# Altium schematic sheet display.SchDoc
size A4; SheetNumber: 1; SheetTotal: 1
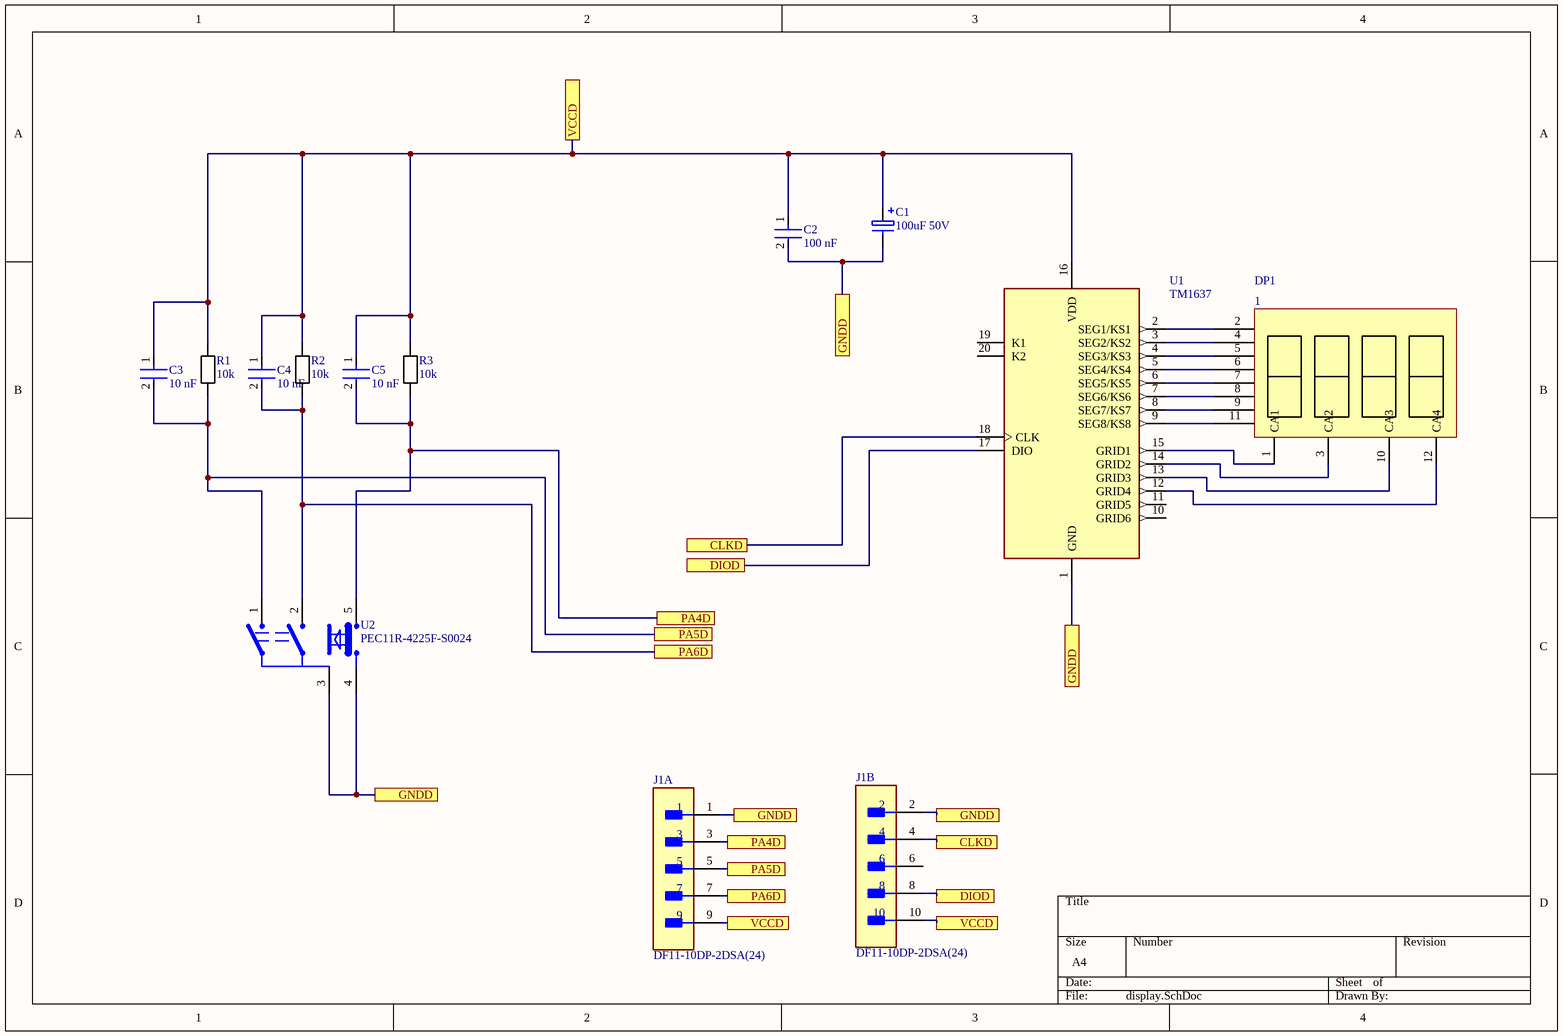
[diagram p0: display.SchDoc]

## Parts
1  DP1  [7sigment]
C1  100uF 50V  [Elco 100uF 50V]
C2  100 nF  [0805]
C3  10 nF  [0805]
C4  10 nF  [0805]
C5  10 nF  [0805]
J1  DF11-10DP-2DSA(24)  [FP-DF11-10DP-2DSA_24-MFG - duplicate]  (parts A,B of 2)
R1  10k  [registor]
R2  10k  [registor]
R3  10k  [registor]
U1  TM1637  [TM1637]
U2  PEC11R-4225F-S0024  [PEC12R-4XXXF-SXXXX_1]

## Ports
CLKD (see display[2C]), CLKD (see display[3D]), DIOD (see display[2C]), DIOD (see display[3D]), GNDD (see display[1D], display[2D], display[3B], display[3C]), GNDD (see display[1D], display[2D], display[3B], display[3D]), GNDD (see display[1D], display[2D], display[3C], display[3D]), GNDD (see display[1D], display[3B], display[3C], display[3D]), GNDD (see display[2D], display[3B], display[3C], display[3D]), PA4D (see display[2C]), PA4D (see display[2D]), PA5D (see display[2C]), PA5D (see display[2D]), PA6D (see display[2C]), PA6D (see display[2D]), VCCD (see display[2A], display[2D]), VCCD (see display[2A], display[3D]), VCCD (see display[2D], display[3D])

## Nets
CLKD: J1.4 U1.18(CLK) ; port CLKD
DIOD: J1.8 U1.17(DIO) ; port DIOD
GNDD: C1.2 C2.2 J1.1 J1.2 U1.1(GND) U2.3 U2.4 ; port GNDD
PA4D: C5.2 J1.3 R3.1 U2.5 ; port PA4D
PA5D: C3.2 J1.5 R1.1 U2.1 ; port PA5D
PA6D: C4.2 J1.7 R2.1 U2.2 ; port PA6D
VCCD: C1.1 C2.1 C3.1 C4.1 C5.1 J1.9 J1.10 R1.2 R2.2 R3.2 U1.16(VDD) ; port VCCD
Net1_1: 1.1(CA1) U1.15(GRID1)
Net1_2: 1.2 U1.2(SEG1/KS1)
Net1_3: 1.3(CA2) U1.14(GRID2)
Net1_4: 1.4 U1.3(SEG2/KS2)
Net1_5: 1.5 U1.4(SEG3/KS3)
Net1_6: 1.6 U1.5(SEG4/KS4)
Net1_7: 1.7 U1.6(SEG5/KS5)
Net1_8: 1.8 U1.7(SEG6/KS6)
Net1_9: 1.9 U1.8(SEG7/KS7)
Net1_10: 1.10(CA3) U1.13(GRID3)
Net1_11: 1.11 U1.9(SEG8/KS8)
Net1_12: 1.12(CA4) U1.12(GRID4)

Not connected (* = marked no-connect by the designer): J1 6; U1 10(GRID6) 11(GRID5) 19(K1) 20(K2)

## Library data of the parts
1 = 7sigment
C1 = condensator 100uF 50V: Part Number: 02015A270JAT2A; Manufacturer: AVX Interconnect / Elco
C2-C5 = Condensator 0805: Chip Multilayer Ceramic Capacitors for General Purpose, 0805, 10uF, X5R, 15%, 10%, 25V; Length: 2mm; Depth: 1.25mm; Termination: SMD/SMT; Voltage: 25V; Height: 1.25mm; Material: Ceramic; Thickness: 0.053inch; Radiation Hardening: No; Min Operating Temperature: -55°C; Width: 0.049inch; Package Quantity: 1; Mount: Surface Mount; Dielectric: X5R; Packaging: Tape and Reel; Capacitance: 10uF; Voltage Rating (DC): 25V; Lead Free: Lead Free; Max Operating Temperature: 85°C; Case Code (Imperial): 0805; Case/Package: 0805; Tolerance: 10%; Voltage Rating: 25V; Case Code (Metric): 2012
J1 = CMP-11610-000008-1: CONN HEADER VERT 10POS 2MM; Manufacturer: Hirose; Number Of Contacts: 10; Voltage Rating: 250V; Conn Orientation: Straight; Conn Gender: Male; Current Rating: 2A; Temperature Range High: +85°C; RoHS: TRUE; Device Class L2: Headers and Wire Housings; ComponentLink2URL: https://www.hirose.com/product/document?clcode=CL0543-0520-0-24&productname=DF11-10DP-2DSA(24)&series=DF11&documenttype=Catalog&lang=en&documentid=D31688_en; Height: 6.9mm; Package: DF11-10DP-2DSA(24); ComponentLink2Description: Datasheet; Automotive: No; Digikey Description: CONN HEADER VERT 10POS 2MM; Manufacturer Part Number: DF11-10DP-2DSA(24); Temperature: -40°C to +85°C; Octopart: https://octopart.com/df11-10dp-2dsa%2824%29-hirose-39521433; Number Of Rows: 2; Device Class L3: unset; Contact Material: Tin,Nickel; Mouser Description: Headers & Wire Housings 10P STRT HEADER THRU HL,BD MNT,SN; Category: Conn; Device Class L1: Connectors; Temperature Range Low: -40°C; Pitch: 2mm; Lead Free: Yes; Footprint Url: https://www.hirose.com/product/document?clcode=CL0543-0520-0-24&productname=DF11-10DP-2DSA(24)&series=DF11&documenttype=2DDrawing&lang=en&documentid=0000995333
R1-R3 = resistor: Manufacturer: Vishay Dale; Part Number: CRCW08050000Z0EA
U1 = TM1637: LED Drive Control Special Circuit; MF: Titan Micro Electronics; Package: Package; Availability: Not in stock; SnapEDA_Link: https://www.snapeda.com/parts/TM1637/Titan+Micro+Electronics/view-part/?ref=snap; MP: TM1637; Check_prices: https://www.snapeda.com/parts/TM1637/Titan+Micro+Electronics/view-part/?ref=eda; Value: *; Price: None
U2 = encoder: Rotary Button; Manufacturer_Name: Bourns; Datasheet Link: https://componentsearchengine.com/Datasheets/1/PEC11R-4225F-S0024.pdf; Manufacturer_Part_Number: PEC11R-4225F-S0024; Mouser Part Number: 652-PEC11R-4225F-S24; Mouser Price/Stock: https://www.mouser.co.uk/ProductDetail/Bourns/PEC11R-4225F-S0024?qs=Zq5ylnUbLm4N6UNkPX3pkQ%3D%3D; Arrow Part Number: PEC11R-4225F-S0024; Arrow Price/Stock: https://www.arrow.com/en/products/pec11r-4225f-s0024/bourns?region=nac